# Altium project 16SoundsUSB.PrjPCB (part 2 of 2)
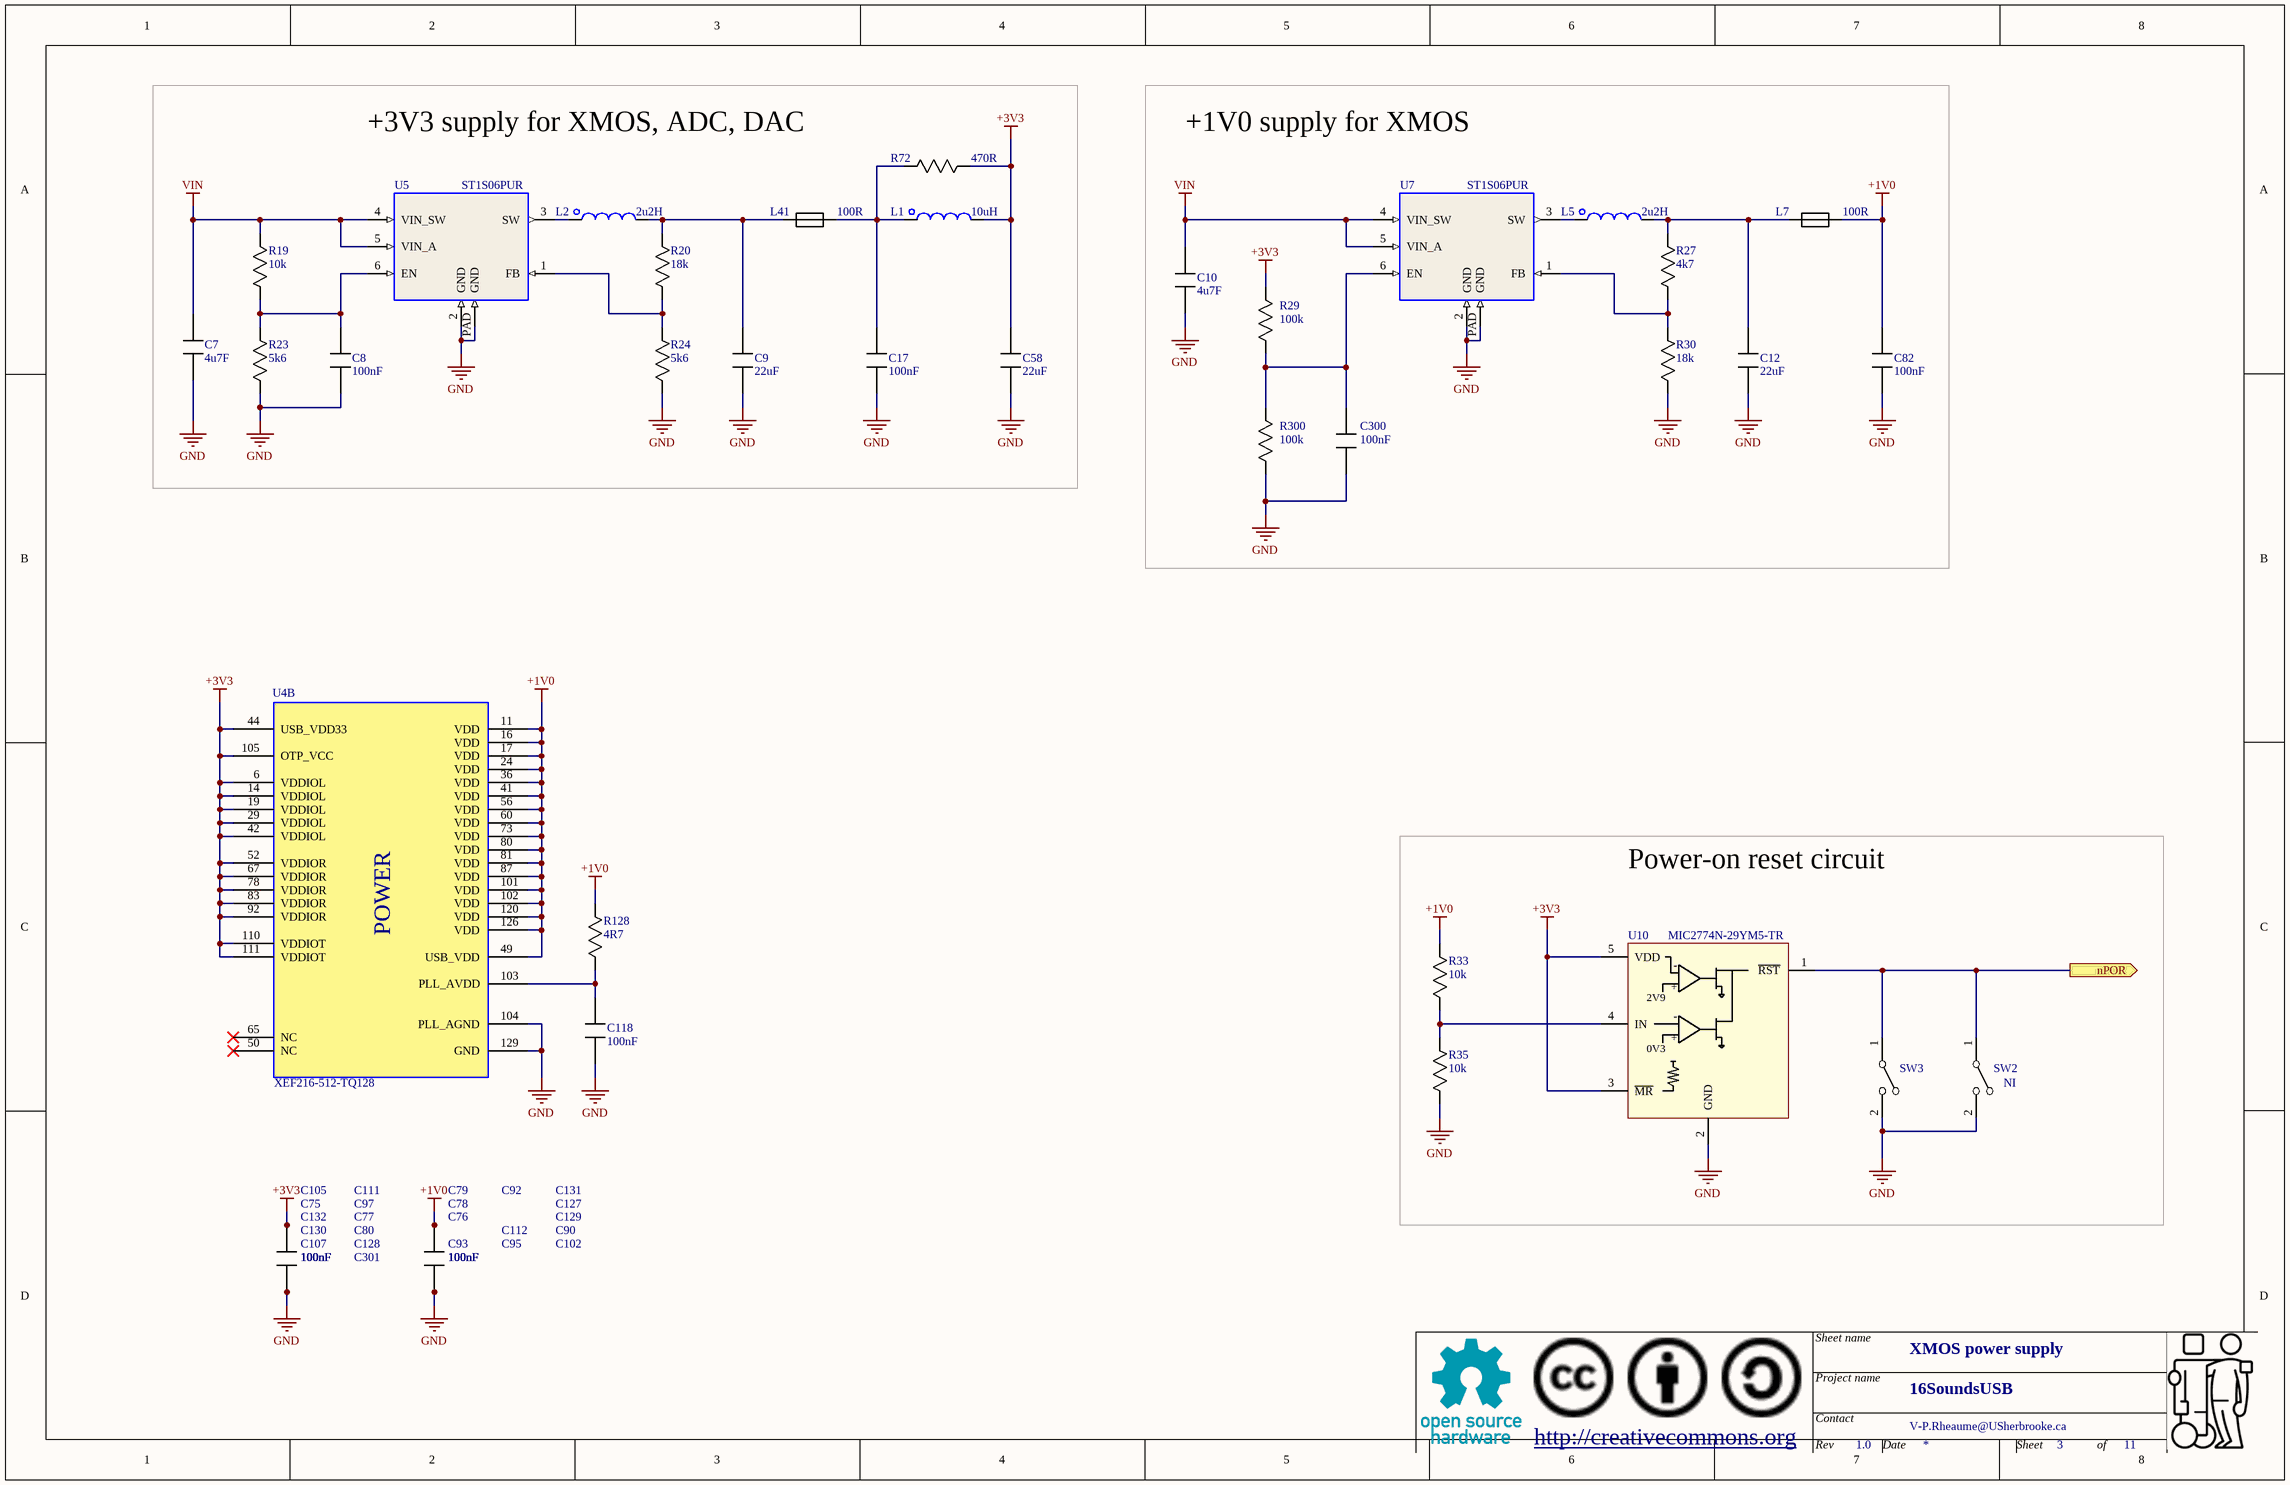
[diagram p9: XMOS_power.SchDoc]

## Nets that join several sheets
+1V0: TopLevel (TP12.1 TP12.2), XMOS_power (33 pins)
+3V3: TopLevel (TP9.1 TP9.2), Clock (5 pins), ADC2 (7 pins), ADC1 (8 pins), DAC (6 pins), Other (R4.2 R6.2 R41.2), XMOS_power (31 pins)
+5V_OFFBOARD: TopLevel (TP11.1 TP11.2), AudioInputs_9-15/InputAmplifier1 (5 pins), AudioInputs_9-15/InputAmplifier2 (5 pins), AudioInputs_9-15/InputAmplifier3 (5 pins), AudioInputs_9-15/InputAmplifier4 (5 pins), AudioInputs_9-15/InputAmplifier5 (5 pins), AudioInputs_9-15/InputAmplifier6 (5 pins), AudioInputs_9-15/InputAmplifier7 (5 pins), AudioInputs_9-15/InputAmplifier8 (5 pins), AudioInputs_1-8/InputAmplifier1 (5 pins), AudioInputs_1-8/InputAmplifier2 (5 pins), AudioInputs_1-8/InputAmplifier3 (5 pins), AudioInputs_1-8/InputAmplifier4 (5 pins), AudioInputs_1-8/InputAmplifier5 (5 pins), AudioInputs_1-8/InputAmplifier6 (5 pins), AudioInputs_1-8/InputAmplifier7 (5 pins), AudioInputs_1-8/InputAmplifier8 (5 pins), DAC (C25.1 C31.1 U17.32), OutputConnectors (D6123.2 D6124.2 D6125.2 D6126.2)
+5V_PREREG: TopLevel (TP10.1 TP10.2), ADC2 (C18_ADC2.1 U13_ADC2.3), ADC1 (C18_ADC1.1 U13_ADC1.3), Other (P19.1)
GND: TopLevel (10 pins), AudioInputs_9-15/InputAmplifier1 (9 pins), AudioInputs_9-15/InputAmplifier2 (9 pins), AudioInputs_9-15/InputAmplifier3 (9 pins), AudioInputs_9-15/InputAmplifier4 (9 pins), AudioInputs_9-15/InputAmplifier5 (9 pins), AudioInputs_9-15/InputAmplifier6 (9 pins), AudioInputs_9-15/InputAmplifier7 (9 pins), AudioInputs_9-15/InputAmplifier8 (9 pins), Clock (5 pins), AudioInputs_1-8/InputAmplifier1 (9 pins), AudioInputs_1-8/InputAmplifier2 (9 pins), AudioInputs_1-8/InputAmplifier3 (9 pins), AudioInputs_1-8/InputAmplifier4 (9 pins), AudioInputs_1-8/InputAmplifier5 (9 pins), AudioInputs_1-8/InputAmplifier6 (9 pins), AudioInputs_1-8/InputAmplifier7 (9 pins), AudioInputs_1-8/InputAmplifier8 (9 pins), ADC2 (26 pins), ADC1 (25 pins), DAC (26 pins), OutputConnectors (14 pins), Other (5 pins), XMOS_power (47 pins)
ADC1_VQ: AudioInputs_1-8/InputAmplifier1 (C55_AudioInputs_1-8_InputAmplifier1.1 R25_AudioInputs_1-8_InputAmplifier1.1 R31_AudioInputs_1-8_InputAmplifier1.2), AudioInputs_1-8/InputAmplifier2 (C55_AudioInputs_1-8_InputAmplifier2.1 R25_AudioInputs_1-8_InputAmplifier2.1 R31_AudioInputs_1-8_InputAmplifier2.2), AudioInputs_1-8/InputAmplifier3 (C55_AudioInputs_1-8_InputAmplifier3.1 R25_AudioInputs_1-8_InputAmplifier3.1 R31_AudioInputs_1-8_InputAmplifier3.2), AudioInputs_1-8/InputAmplifier4 (C55_AudioInputs_1-8_InputAmplifier4.1 R25_AudioInputs_1-8_InputAmplifier4.1 R31_AudioInputs_1-8_InputAmplifier4.2), AudioInputs_1-8/InputAmplifier5 (C55_AudioInputs_1-8_InputAmplifier5.1 R25_AudioInputs_1-8_InputAmplifier5.1 R31_AudioInputs_1-8_InputAmplifier5.2), AudioInputs_1-8/InputAmplifier6 (C55_AudioInputs_1-8_InputAmplifier6.1 R25_AudioInputs_1-8_InputAmplifier6.1 R31_AudioInputs_1-8_InputAmplifier6.2), AudioInputs_1-8/InputAmplifier7 (C55_AudioInputs_1-8_InputAmplifier7.1 R25_AudioInputs_1-8_InputAmplifier7.1 R31_AudioInputs_1-8_InputAmplifier7.2), AudioInputs_1-8/InputAmplifier8 (C55_AudioInputs_1-8_InputAmplifier8.1 R25_AudioInputs_1-8_InputAmplifier8.1 R31_AudioInputs_1-8_InputAmplifier8.2), ADC1 (C22_ADC1.1 C23_ADC1.1 U14_ADC1.7)
ADC2_VQ: AudioInputs_9-15/InputAmplifier1 (C55_AudioInputs_9-15_InputAmplifier1.1 R25_AudioInputs_9-15_InputAmplifier1.1 R31_AudioInputs_9-15_InputAmplifier1.2), AudioInputs_9-15/InputAmplifier2 (C55_AudioInputs_9-15_InputAmplifier2.1 R25_AudioInputs_9-15_InputAmplifier2.1 R31_AudioInputs_9-15_InputAmplifier2.2), AudioInputs_9-15/InputAmplifier3 (C55_AudioInputs_9-15_InputAmplifier3.1 R25_AudioInputs_9-15_InputAmplifier3.1 R31_AudioInputs_9-15_InputAmplifier3.2), AudioInputs_9-15/InputAmplifier4 (C55_AudioInputs_9-15_InputAmplifier4.1 R25_AudioInputs_9-15_InputAmplifier4.1 R31_AudioInputs_9-15_InputAmplifier4.2), AudioInputs_9-15/InputAmplifier5 (C55_AudioInputs_9-15_InputAmplifier5.1 R25_AudioInputs_9-15_InputAmplifier5.1 R31_AudioInputs_9-15_InputAmplifier5.2), AudioInputs_9-15/InputAmplifier6 (C55_AudioInputs_9-15_InputAmplifier6.1 R25_AudioInputs_9-15_InputAmplifier6.1 R31_AudioInputs_9-15_InputAmplifier6.2), AudioInputs_9-15/InputAmplifier7 (C55_AudioInputs_9-15_InputAmplifier7.1 R25_AudioInputs_9-15_InputAmplifier7.1 R31_AudioInputs_9-15_InputAmplifier7.2), AudioInputs_9-15/InputAmplifier8 (C55_AudioInputs_9-15_InputAmplifier8.1 R25_AudioInputs_9-15_InputAmplifier8.1 R31_AudioInputs_9-15_InputAmplifier8.2), ADC2 (C22_ADC2.1 C23_ADC2.1 U14_ADC2.7)
I2C_SCL: TopLevel (TP1.1 TP1.2), Clock (U2.9), ADC2 (U14_ADC2.39), ADC1 (U14_ADC1.39), DAC (U17.15), Other (P19.3)
I2C_SDA: TopLevel (TP2.1 TP2.2), Clock (U2.10), ADC2 (U14_ADC2.40), ADC1 (U14_ADC1.40), DAC (U17.16), Other (P19.4)
IN1_N: AudioInputs_1-8/InputAmplifier1 (C33_AudioInputs_1-8_InputAmplifier1.2 R34_AudioInputs_1-8_InputAmplifier1.2 R43_AudioInputs_1-8_InputAmplifier1.2), ADC1 (U14_ADC1.16)
IN1_P: AudioInputs_1-8/InputAmplifier1 (C33_AudioInputs_1-8_InputAmplifier1.1 R26_AudioInputs_1-8_InputAmplifier1.2 R69_AudioInputs_1-8_InputAmplifier1.2), ADC1 (U14_ADC1.15)
IN2_N: AudioInputs_1-8/InputAmplifier2 (C33_AudioInputs_1-8_InputAmplifier2.2 R34_AudioInputs_1-8_InputAmplifier2.2 R43_AudioInputs_1-8_InputAmplifier2.2), ADC1 (U14_ADC1.18)
IN2_P: AudioInputs_1-8/InputAmplifier2 (C33_AudioInputs_1-8_InputAmplifier2.1 R26_AudioInputs_1-8_InputAmplifier2.2 R69_AudioInputs_1-8_InputAmplifier2.2), ADC1 (U14_ADC1.17)
IN3_N: AudioInputs_1-8/InputAmplifier3 (C33_AudioInputs_1-8_InputAmplifier3.2 R34_AudioInputs_1-8_InputAmplifier3.2 R43_AudioInputs_1-8_InputAmplifier3.2), ADC1 (U14_ADC1.14)
IN3_P: AudioInputs_1-8/InputAmplifier3 (C33_AudioInputs_1-8_InputAmplifier3.1 R26_AudioInputs_1-8_InputAmplifier3.2 R69_AudioInputs_1-8_InputAmplifier3.2), ADC1 (U14_ADC1.13)
IN4_N: AudioInputs_1-8/InputAmplifier4 (C33_AudioInputs_1-8_InputAmplifier4.2 R34_AudioInputs_1-8_InputAmplifier4.2 R43_AudioInputs_1-8_InputAmplifier4.2), ADC1 (U14_ADC1.12)
IN4_P: AudioInputs_1-8/InputAmplifier4 (C33_AudioInputs_1-8_InputAmplifier4.1 R26_AudioInputs_1-8_InputAmplifier4.2 R69_AudioInputs_1-8_InputAmplifier4.2), ADC1 (U14_ADC1.11)
IN5_N: AudioInputs_1-8/InputAmplifier5 (C33_AudioInputs_1-8_InputAmplifier5.2 R34_AudioInputs_1-8_InputAmplifier5.2 R43_AudioInputs_1-8_InputAmplifier5.2), ADC1 (U14_ADC1.48)
IN5_P: AudioInputs_1-8/InputAmplifier5 (C33_AudioInputs_1-8_InputAmplifier5.1 R26_AudioInputs_1-8_InputAmplifier5.2 R69_AudioInputs_1-8_InputAmplifier5.2), ADC1 (U14_ADC1.47)
IN6_N: AudioInputs_1-8/InputAmplifier6 (C33_AudioInputs_1-8_InputAmplifier6.2 R34_AudioInputs_1-8_InputAmplifier6.2 R43_AudioInputs_1-8_InputAmplifier6.2), ADC1 (U14_ADC1.2)
IN6_P: AudioInputs_1-8/InputAmplifier6 (C33_AudioInputs_1-8_InputAmplifier6.1 R26_AudioInputs_1-8_InputAmplifier6.2 R69_AudioInputs_1-8_InputAmplifier6.2), ADC1 (U14_ADC1.1)
IN7_N: AudioInputs_1-8/InputAmplifier7 (C33_AudioInputs_1-8_InputAmplifier7.2 R34_AudioInputs_1-8_InputAmplifier7.2 R43_AudioInputs_1-8_InputAmplifier7.2), ADC1 (U14_ADC1.46)
IN7_P: AudioInputs_1-8/InputAmplifier7 (C33_AudioInputs_1-8_InputAmplifier7.1 R26_AudioInputs_1-8_InputAmplifier7.2 R69_AudioInputs_1-8_InputAmplifier7.2), ADC1 (U14_ADC1.45)
IN8_N: AudioInputs_1-8/InputAmplifier8 (C33_AudioInputs_1-8_InputAmplifier8.2 R34_AudioInputs_1-8_InputAmplifier8.2 R43_AudioInputs_1-8_InputAmplifier8.2), ADC1 (U14_ADC1.44)
IN8_P: AudioInputs_1-8/InputAmplifier8 (C33_AudioInputs_1-8_InputAmplifier8.1 R26_AudioInputs_1-8_InputAmplifier8.2 R69_AudioInputs_1-8_InputAmplifier8.2), ADC1 (U14_ADC1.43)
IN9_N: AudioInputs_9-15/InputAmplifier1 (C33_AudioInputs_9-15_InputAmplifier1.2 R34_AudioInputs_9-15_InputAmplifier1.2 R43_AudioInputs_9-15_InputAmplifier1.2), ADC2 (U14_ADC2.16)
IN9_P: AudioInputs_9-15/InputAmplifier1 (C33_AudioInputs_9-15_InputAmplifier1.1 R26_AudioInputs_9-15_InputAmplifier1.2 R69_AudioInputs_9-15_InputAmplifier1.2), ADC2 (U14_ADC2.15)
IN10_N: AudioInputs_9-15/InputAmplifier2 (C33_AudioInputs_9-15_InputAmplifier2.2 R34_AudioInputs_9-15_InputAmplifier2.2 R43_AudioInputs_9-15_InputAmplifier2.2), ADC2 (U14_ADC2.18)
IN10_P: AudioInputs_9-15/InputAmplifier2 (C33_AudioInputs_9-15_InputAmplifier2.1 R26_AudioInputs_9-15_InputAmplifier2.2 R69_AudioInputs_9-15_InputAmplifier2.2), ADC2 (U14_ADC2.17)
IN11_N: AudioInputs_9-15/InputAmplifier3 (C33_AudioInputs_9-15_InputAmplifier3.2 R34_AudioInputs_9-15_InputAmplifier3.2 R43_AudioInputs_9-15_InputAmplifier3.2), ADC2 (U14_ADC2.14)
IN11_P: AudioInputs_9-15/InputAmplifier3 (C33_AudioInputs_9-15_InputAmplifier3.1 R26_AudioInputs_9-15_InputAmplifier3.2 R69_AudioInputs_9-15_InputAmplifier3.2), ADC2 (U14_ADC2.13)
IN12_N: AudioInputs_9-15/InputAmplifier4 (C33_AudioInputs_9-15_InputAmplifier4.2 R34_AudioInputs_9-15_InputAmplifier4.2 R43_AudioInputs_9-15_InputAmplifier4.2), ADC2 (U14_ADC2.12)
IN12_P: AudioInputs_9-15/InputAmplifier4 (C33_AudioInputs_9-15_InputAmplifier4.1 R26_AudioInputs_9-15_InputAmplifier4.2 R69_AudioInputs_9-15_InputAmplifier4.2), ADC2 (U14_ADC2.11)
IN13_N: AudioInputs_9-15/InputAmplifier5 (C33_AudioInputs_9-15_InputAmplifier5.2 R34_AudioInputs_9-15_InputAmplifier5.2 R43_AudioInputs_9-15_InputAmplifier5.2), ADC2 (U14_ADC2.48)
IN13_P: AudioInputs_9-15/InputAmplifier5 (C33_AudioInputs_9-15_InputAmplifier5.1 R26_AudioInputs_9-15_InputAmplifier5.2 R69_AudioInputs_9-15_InputAmplifier5.2), ADC2 (U14_ADC2.47)
IN14_N: AudioInputs_9-15/InputAmplifier6 (C33_AudioInputs_9-15_InputAmplifier6.2 R34_AudioInputs_9-15_InputAmplifier6.2 R43_AudioInputs_9-15_InputAmplifier6.2), ADC2 (U14_ADC2.2)
IN14_P: AudioInputs_9-15/InputAmplifier6 (C33_AudioInputs_9-15_InputAmplifier6.1 R26_AudioInputs_9-15_InputAmplifier6.2 R69_AudioInputs_9-15_InputAmplifier6.2), ADC2 (U14_ADC2.1)
IN15_N: AudioInputs_9-15/InputAmplifier7 (C33_AudioInputs_9-15_InputAmplifier7.2 R34_AudioInputs_9-15_InputAmplifier7.2 R43_AudioInputs_9-15_InputAmplifier7.2), ADC2 (U14_ADC2.46)
IN15_P: AudioInputs_9-15/InputAmplifier7 (C33_AudioInputs_9-15_InputAmplifier7.1 R26_AudioInputs_9-15_InputAmplifier7.2 R69_AudioInputs_9-15_InputAmplifier7.2), ADC2 (U14_ADC2.45)
IN16_N: AudioInputs_9-15/InputAmplifier8 (C33_AudioInputs_9-15_InputAmplifier8.2 R34_AudioInputs_9-15_InputAmplifier8.2 R43_AudioInputs_9-15_InputAmplifier8.2), ADC2 (U14_ADC2.44)
IN16_P: AudioInputs_9-15/InputAmplifier8 (C33_AudioInputs_9-15_InputAmplifier8.1 R26_AudioInputs_9-15_InputAmplifier8.2 R69_AudioInputs_9-15_InputAmplifier8.2), ADC2 (U14_ADC2.43)
LRCLK: TopLevel (TP6.1 TP6.2), ADC2 (U14_ADC2.24), ADC1 (U14_ADC1.24), DAC (U17.7)
MCLK_AUDIO: TopLevel (R65.1 R66.2 TP4.1 TP4.2), ADC2 (U14_ADC2.23), ADC1 (U14_ADC1.23), DAC (U17.6)
NetC36_+: DAC (U17.39), OutputConnectors (C36.+ D6126.3)
NetC37_+: DAC (U17.35), OutputConnectors (C37.+ D6124.3)
NetC40_+: DAC (U17.38), OutputConnectors (C40.+ D6125.3)
NetC41_+: DAC (U17.34), OutputConnectors (C41.+ D6123.3)
NetR2_2: TopLevel (R65.2), Clock (R2.2)
NetR7_ADC1_2: TopLevel (TP7.1 TP7.2), ADC2 (R7_ADC2.2 U14_ADC2.36), ADC1 (R7_ADC1.2 U14_ADC1.36)
NetTP3_1: TopLevel (TP3.1 TP3.2), ADC2 (U14_ADC2.41), ADC1 (U14_ADC1.41)
SCLK: TopLevel (TP5.1 TP5.2), ADC2 (U14_ADC2.25), ADC1 (U14_ADC1.25), DAC (U17.9)